# EAGLE design amp_test2 (EAGLE 7.6.0)
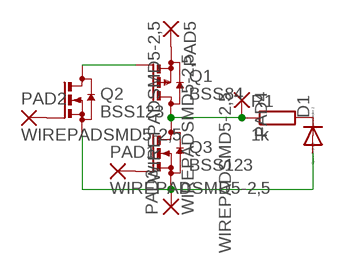
[diagram p0: schematic, sheet 1]

## Parts
D1  DIODE-SOD323-R  [SOD323-R]
PAD1  WIREPADSMD5-2,5  [5-2,5]
PAD2  WIREPADSMD5-2,5  [5-2,5]
PAD3  WIREPADSMD5-2,5  [5-2,5]
PAD4  WIREPADSMD5-2,5  [5-2,5]
PAD5  WIREPADSMD5-2,5  [5-2,5]
Q1  BSS84  [SOT23]
Q2  BSS123  [SOT23]
Q3  BSS123  [SOT23]
R1  1k  R-EU_R0603  [R0603]

## Nets
N$1: PAD1.1(P) Q3.1(G)
N$2: PAD2.1(P) Q2.1(G)
N$3: D1.A PAD3.1(P) Q2.2(S) Q3.2(S)
N$4: PAD4.1(P) Q1.3(D) Q3.3(D) R1.1
N$5: D1.C R1.2
N$6: Q1.1(G) Q2.3(D)
N$7: PAD5.1(P) Q1.2(S)

## Library data of the parts
D1 = diode:DIODE-: DIODE
PAD1-PAD5 = wirepad:WIREPAD: Wire PAD connect wire on PCB
Q1 = transistor-small-signal:BSS84: P-CHANNEL MOS FET
Q2 Q3 = transistor-small-signal:BSS123: N-CHANNEL MOS FET
R1 = rcl:R-EU_: RESISTOR, European symbol

## Net classes
0 default: width 0.889 mm

## Board
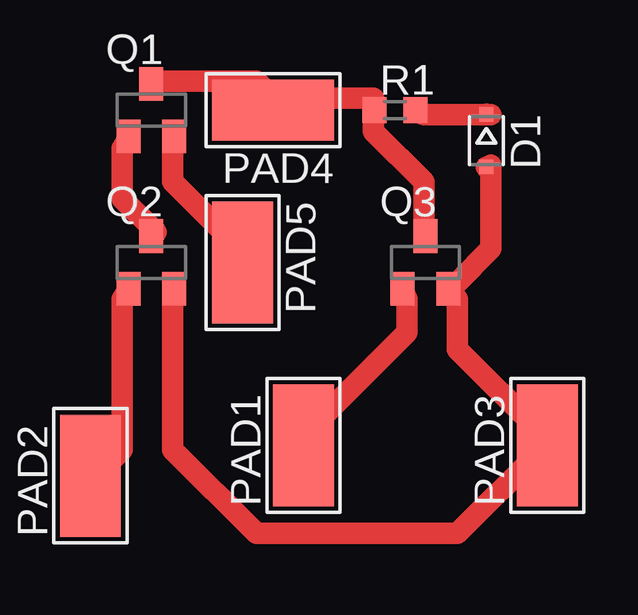
[diagram p1: board, top side]

No outline drawn. Coordinates in mm, seen from the top.
Copper layers (1*16): Top 0.035mm / dielectric 1.5mm / Bottom 0.035mm
Design rules "default *": minimum track width 10mil, minimum drill 24mil, track to track 20mil, track to pad 20mil, pad to pad 20mil, via to via 20mil, smd to smd 20mil, copper to edge 40mil, drill to drill 8mil, minimum pad ring 10mil, minimum via ring 8mil, stop-mask expansion 4mil, vias tented up to drill 0mil, thermal gap 10mil

### Footprints (pad centres in the part's own frame; a part is rotated, then mirrored left to right if it is on the bottom)
SOD323-R = smd 0.6 x 0.6: A 1.1,0; C -1.1,0
5-2,5 = smd 2.54 x 5.08: 1 0,0
SOT23 = smd 1 x 1.4: 1 -0.95,-1.1; 2 0.95,-1.1; 3 0,1.1
R0603 = smd 1 x 1.1: 1 -0.85,0; 2 0.85,0

### Placement (x,y rotation side)
D1  22.86,17.78 270 top
PAD1  15.24,5.08 0 top
PAD2  6.35,3.81 0 top
PAD3  25.4,5.08 0 top
PAD4  13.97,19.05 90 top
PAD5  12.7,12.7 180 top
Q1  8.89,19.05 0 top
Q2  8.89,12.7 0 top
Q3  20.32,12.7 0 top
R1  19.05,19.05 0 top

### Tracks (layer width: path | path; a pad name or v marks a point on that pad's centre or on a via)
N$1
  Top 0.889: Q3.1 19.56,11.18 19.56,9.78 15.37,5.59 PAD1.1
N$2
  Top 0.889: Q2.1 7.68,11.18 7.68,4.89 6.99,4.19 PAD2.1
N$3
  Top 0.889: D1.A 23.05,16.76 23.05,13.27 21.65,11.87 Q3.2 21.65,11.18 21.65,9.08 25.15,5.59 PAD3.1 25.15,4.89 21.65,1.4 13.27,1.4 9.78,4.89 9.78,11.18 Q2.2
N$4
  Top 0.889: 13.97,19.56 18.16,19.56 R1.1 18.16,18.86 18.16,18.16 20.26,16.07 20.26,13.97 Q3.3 | 13.97,19.56 13.27,20.26 9.08,20.26 Q1.3 | 13.97,19.56 PAD4.1
N$5
  Top 0.889: D1.C 23.05,18.86 20.26,18.86 R1.2
N$6
  Top 0.889: Q1.1 7.68,17.46 7.68,15.37 9.08,13.97 Q2.3
N$7
  Top 0.889: Q1.2 9.78,17.46 9.78,16.07 12.57,13.27 PAD5.1